# EAGLE design Emanuel textured walkway V1 (EAGLE 9.6.2)
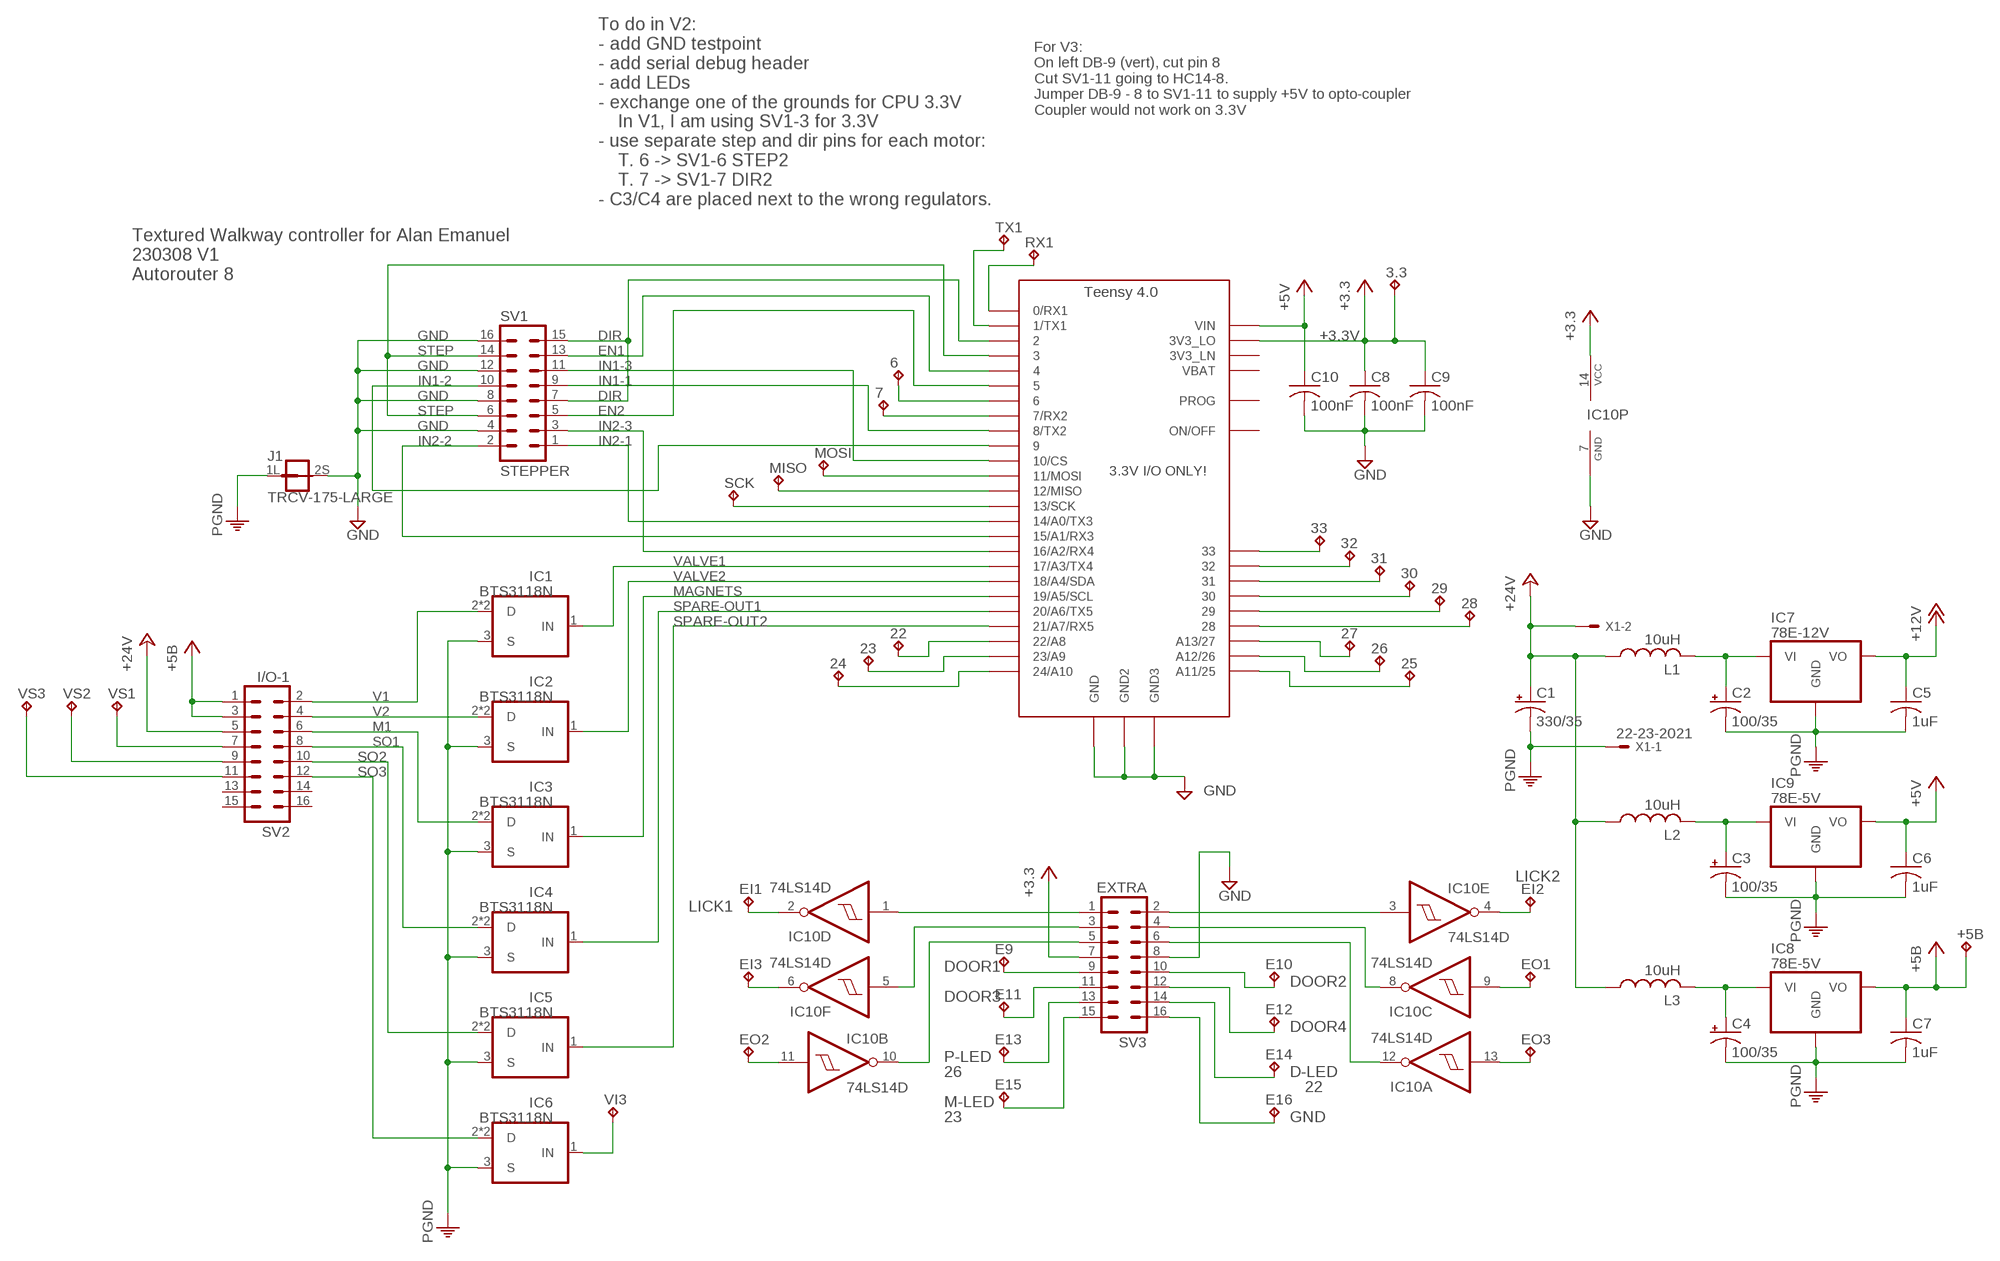
[diagram p0: schematic, sheet 1]

## Parts
3.3  3.3  TP-040-100  [P1-040-100]
6  TP-040-100  [P1-040-100]
7  TP-040-100  [P1-040-100]
22  TP-040-100  [P1-040-100]
23  TP-040-100  [P1-040-100]
24  TP-040-100  [P1-040-100]
25  TP-040-100  [P1-040-100]
26  TP-040-100  [P1-040-100]
27  TP-040-100  [P1-040-100]
28  TP-040-100  [P1-040-100]
29  TP-040-100  [P1-040-100]
30  TP-040-100  [P1-040-100]
31  TP-040-100  [P1-040-100]
32  TP-040-100  [P1-040-100]
33  TP-040-100  [P1-040-100]
+5B  TP-040-100  [P1-040-100]
C1  330/35  CPOL-US140CLH-1010  [140CLH-1010]
C2  100/35  CPOL-US140CLH-0810  [140CLH-0810]
C3  100/35  CPOL-US140CLH-0810  [140CLH-0810]
C4  100/35  CPOL-US140CLH-0810  [140CLH-0810]
C5  1uF  C-USC0805  [C0805]
C6  1uF  C-USC0805  [C0805]
C7  1uF  C-USC0805  [C0805]
C8  100nF  C-USC0805  [C0805]
C9  100nF  C-USC0805  [C0805]
C10  100nF  C-USC0805  [C0805]
E9  TP-040-100  [P1-040-100]
E10  TP-040-100  [P1-040-100]
E11  TP-040-100  [P1-040-100]
E12  TP-040-100  [P1-040-100]
E13  TP-040-100  [P1-040-100]
E14  TP-040-100  [P1-040-100]
E15  TP-040-100  [P1-040-100]
E16  TP-040-100  [P1-040-100]
EI1  TP-040-100  [P1-040-100]
EI2  TP-040-100  [P1-040-100]
EI3  TP-040-100  [P1-040-100]
EO1  TP-040-100  [P1-040-100]
EO2  TP-040-100  [P1-040-100]
EO3  TP-040-100  [P1-040-100]
IC1  BTS3118N  [SOT223]
IC2  BTS3118N  [SOT223]
IC3  BTS3118N  [SOT223]
IC4  BTS3118N  [SOT223]
IC5  BTS3118N  [SOT223]
IC6  BTS3118N  [SOT223]
IC7  78E-12V  RECOM-R-78E  [RECOM-R-78E]
IC8  78E-5V  RECOM-R-78E  [RECOM-R-78E]
IC9  78E-5V  RECOM-R-78E  [RECOM-R-78E]
IC10  74LS14D  [SO14]
J1  TRCV-175-LARGE  [JUMPER-TRACE-CONVERT-LARGER-PADS-175]
L1  10uH  L-USL1812  [L1812]
L2  10uH  L-USL1812  [L1812]
L3  10uH  L-USL1812  [L1812]
MISO  TP-040-100  [P1-040-100]
MOSI  TP-040-100  [P1-040-100]
RX1  TP-040-100  [P1-040-100]
SCK  TP-040-100  [P1-040-100]
SV1  STEPPER  ML16  [ML16]
SV2  I/O-1  ML16  [ML16]
SV3  EXTRA  ML16  [ML16]
TX1  TP-040-100  [P1-040-100]
U$1  TEENSY_4.0_WITH_24-33  [TEENSY_4.0_WITH_24-33]
VI3  TP-040-100  [P1-040-100]
VS1  TP-040-100  [P1-040-100]
VS2  TP-040-100  [P1-040-100]
VS3  TP-040-100  [P1-040-100]
X1  22-23-2021  [22-23-2021]

## Nets
+3.3V [power15]: 3.3.P$1(TP) C8.1 C9.1 IC10.14(P:VCC) SV3.7 U$1.3V3_LO ; supply symbol labelled +3.3
+5B [power15]: +5B.P$1(TP) C7.1 IC8.3(VO) SV2.1 SV2.3
+5V [power15]: C6.1 C10.1 IC9.3(VO) U$1.VIN
+12V [power15]: C5.1 IC7.3(VO)
+24V [power25]: C1.+ L1.1 L2.1 L3.1 SV2.5 X1.2
DIR: SV1.7 SV1.15 U$1.2
EN1: SV1.13 U$1.4
EN2: SV1.5 U$1.5
GND [power15]: C8.2 C9.2 C10.2 IC10.7(P:GND) J1.2S SV1.4 SV1.8 SV1.12 SV1.16 SV3.8 U$1.GND U$1.GND2 U$1.GND3
IN1-1: SV1.9 U$1.8(8/TX2)
IN1-2: SV1.10 U$1.9
IN1-3: SV1.11 U$1.10/CS
IN2-1: SV1.1 U$1.14/A0(14/A0/TX3)
IN2-2: SV1.2 U$1.15/A1(15/A1/RX3)
IN2-3: SV1.3 U$1.16/A2(16/A2/RX4)
M1 [power15]: IC3.2(D) IC3.4(D) SV2.6
MAGNETS: IC3.1(IN) U$1.19/A5/SCL
N$1 [power15]: C2.+ IC7.1(VI) L1.2
N$2 [power15]: C4.+ IC8.1(VI) L3.2
N$3 [power15]: SV2.9 VS2.P$1(TP)
N$4 [power15]: SV2.11 VS3.P$1(TP)
N$5 [power15]: C3.+ IC9.1(VI) L2.2
N$6: IC6.1(IN) VI3.P$1(TP)
N$7: MOSI.P$1(TP) U$1.11/MOSI
N$8: MISO.P$1(TP) U$1.12/MISO
N$9 [power15]: SV2.7 VS1.P$1(TP)
N$10: SCK.P$1(TP) U$1.13/SCK
N$11: 22.P$1(TP) U$1.22/A8
N$12: 23.P$1(TP) U$1.23/A9
N$13: 24.P$1(TP) U$1.24(24/A10)
N$14: 33.P$1(TP) U$1.33
N$15: 32.P$1(TP) U$1.32
N$16: 31.P$1(TP) U$1.31
N$17: 30.P$1(TP) U$1.30
N$18: 29.P$1(TP) U$1.29
N$19: 28.P$1(TP) U$1.28
N$20: 27.P$1(TP) U$1.27(A13/27)
N$21: 26.P$1(TP) U$1.26(A12/26)
N$22: 25.P$1(TP) U$1.25(A11/25)
N$23: RX1.P$1(TP) U$1.0/RX(0/RX1)
N$24: TX1.P$1(TP) U$1.1/TX(1/TX1)
N$25: 6.P$1(TP) U$1.6
N$26: 7.P$1(TP) U$1.7(7/RX2)
N$27: IC10.1(D:I) SV3.1
N$28: IC10.3(E:I) SV3.2
N$29: IC10.5(F:I) SV3.3
N$30: IC10.8(C:O) SV3.4
N$31: IC10.10(B:O) SV3.5
N$32: IC10.12(A:O) SV3.6
N$33: E9.P$1(TP) SV3.9
N$34: E11.P$1(TP) SV3.11
N$35: E13.P$1(TP) SV3.13
N$36: E15.P$1(TP) SV3.15
N$37: E10.P$1(TP) SV3.10
N$38: E12.P$1(TP) SV3.12
N$39: E14.P$1(TP) SV3.14
N$40: E16.P$1(TP) SV3.16
N$41: EI1.P$1(TP) IC10.2(D:O)
N$42: EI3.P$1(TP) IC10.6(F:O)
N$43: EI2.P$1(TP) IC10.4(E:O)
N$44: EO3.P$1(TP) IC10.13(A:I)
N$45: EO1.P$1(TP) IC10.9(C:I)
N$46: EO2.P$1(TP) IC10.11(B:I)
PGND [power25]: C1.- C2.- C3.- C4.- C5.2 C6.2 C7.2 IC1.3(S) IC2.3(S) IC3.3(S) IC4.3(S) IC5.3(S) IC6.3(S) IC7.2(GND) IC8.2(GND) IC9.2(GND) J1.1L X1.1
SO1 [power15]: IC4.2(D) IC4.4(D) SV2.8
SO2 [power15]: IC5.2(D) IC5.4(D) SV2.10
SO3 [power15]: IC6.2(D) IC6.4(D) SV2.12
SPARE-OUT1: IC4.1(IN) U$1.20/A6(20/A6/TX5)
SPARE-OUT2: IC5.1(IN) U$1.21/A7(21/A7/RX5)
STEP: SV1.6 SV1.14 U$1.3
V1 [power15]: IC1.2(D) IC1.4(D) SV2.2
V2 [power15]: IC2.2(D) IC2.4(D) SV2.4
VALVE1: IC1.1(IN) U$1.17/A3(17/A3/TX4)
VALVE2: IC2.1(IN) U$1.18/A4/SDA
Unconnected: SV2.13 SV2.14 SV2.15 SV2.16 U$1.3V3_LN U$1.ON/OFF U$1.PROG U$1.VBAT\(VBAT)

## Notes on the sheet
- For V3:
  On left DB-9 (vert), cut pin 8
  Cut SV1-11 going to HC14-8.
  Jumper DB-9 - 8 to SV1-11 to supply +5V to opto-coupler
  Coupler would not work on 3.3V
- To do in V2:
  - add GND testpoint
  - add serial debug header
  - add LEDs
  - exchange one of the grounds for CPU 3.3V
      In V1, I am using SV1-3 for 3.3V
  - use separate step and dir pins for each motor:
      T. 6 -> SV1-6 STEP2
      T. 7 -> SV1-7 DIR2
  - C3/C4 are placed next to the wrong regulators.
- Textured Walkway controller for Alan Emanuel
  230308 V1
  Autorouter 8
- LICK2
- LICK1
- DOOR1
- DOOR2
- DOOR3
- DOOR4
- P-LED
- 26 | D-LED
- 22
- M-LED
- 23 | GND

## Library data of the parts
3.3 6 7 22-33 +5B E9-E16 EI1-EI3 EO1-EO3 MISO MOSI RX1 SCK TX1 VI3 VS1-VS3 = wng:TP-040-100: Testpoint for Keystone 5002K
C1-C4 = rcl:CPOL-US: POLARIZED CAPACITOR, American symbol
C5-C10 = rcl:C-US: CAPACITOR, American symbol
IC1-IC6 = wng:BTS3118N
IC7-IC9 = wng:RECOM-R-78E
IC10 = 74xx-us:74*14: Hex schmitt trigger INVERTER
J1 = wng:TRCV-175-LARGE: Trace converter with larger pads, for power connections
L1-L3 = rcl:L-US: INDUCTOR, American symbol
SV1-SV3 = con-harting-ml:ML16: HARTING; OC_FARNELL: unknown; OC_NEWARK: unknown
U$1 = TEENSY 4.0:TEENSY_4.0_WITH_24-33
X1 = con-molex:22-23-2021: .100" (2.54mm) Center Header - 2 Pin; MF: MOLEX; MPN: 22-23-2021; OC_FARNELL: 1462926; OC_NEWARK: 25C3832

## Net classes
0 default: width 0.254 mm, drill 0.254 mm, clearance 0.254 mm
1 power15: width 0.381 mm, drill 0.381 mm, clearance 0.381 mm
2 power25: width 0.635 mm, drill 0.381 mm, clearance 0.381 mm

## Board
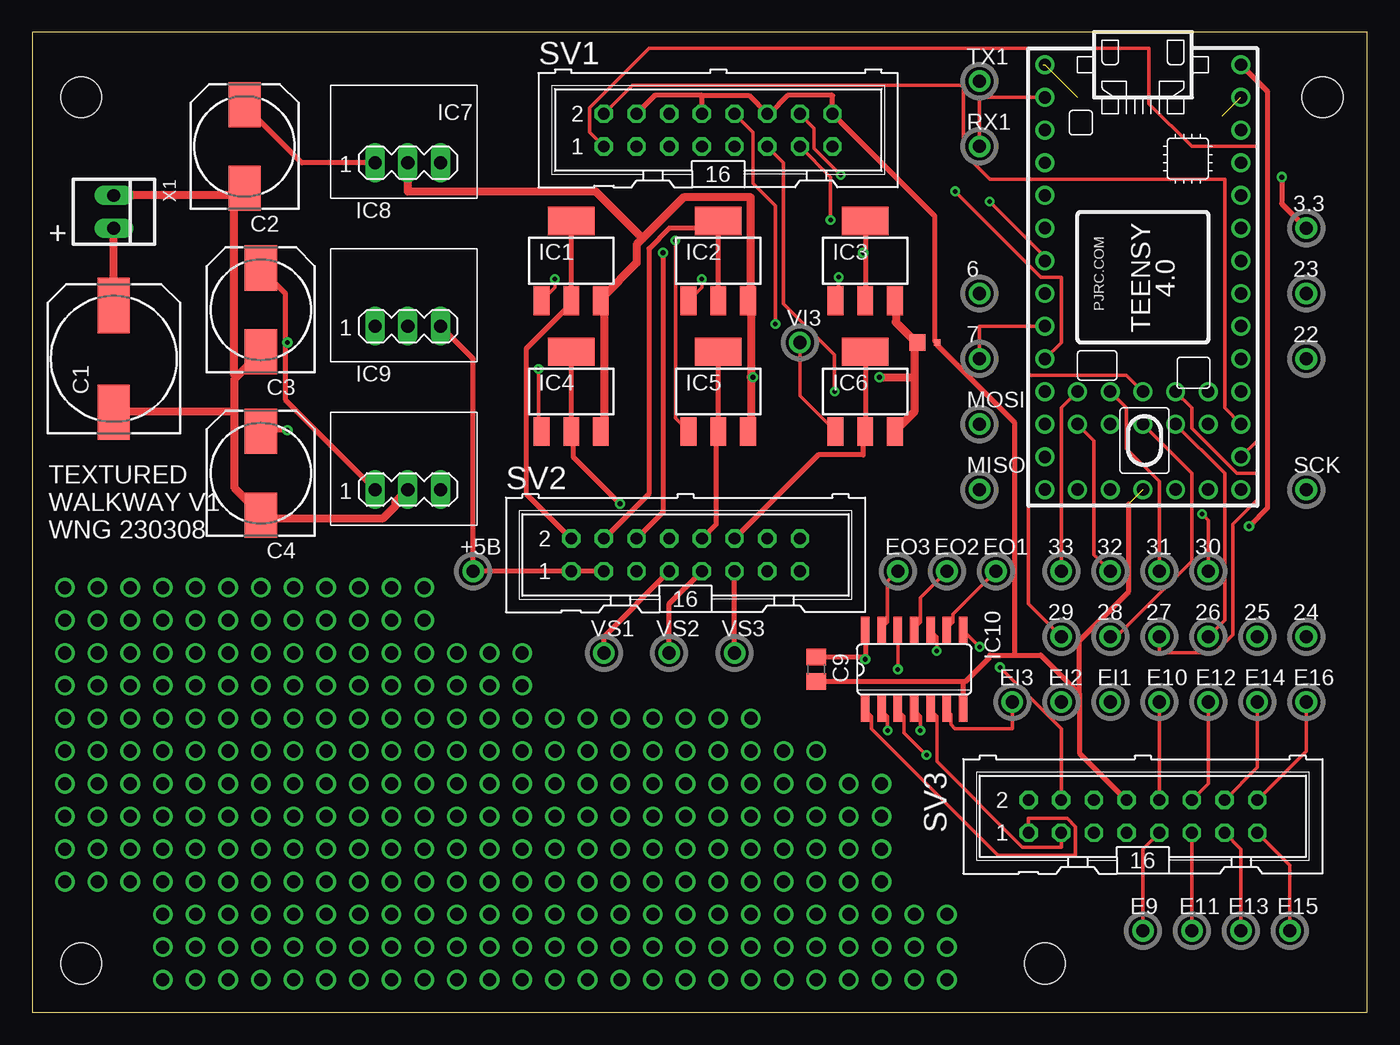
[diagram p1: board, top side]
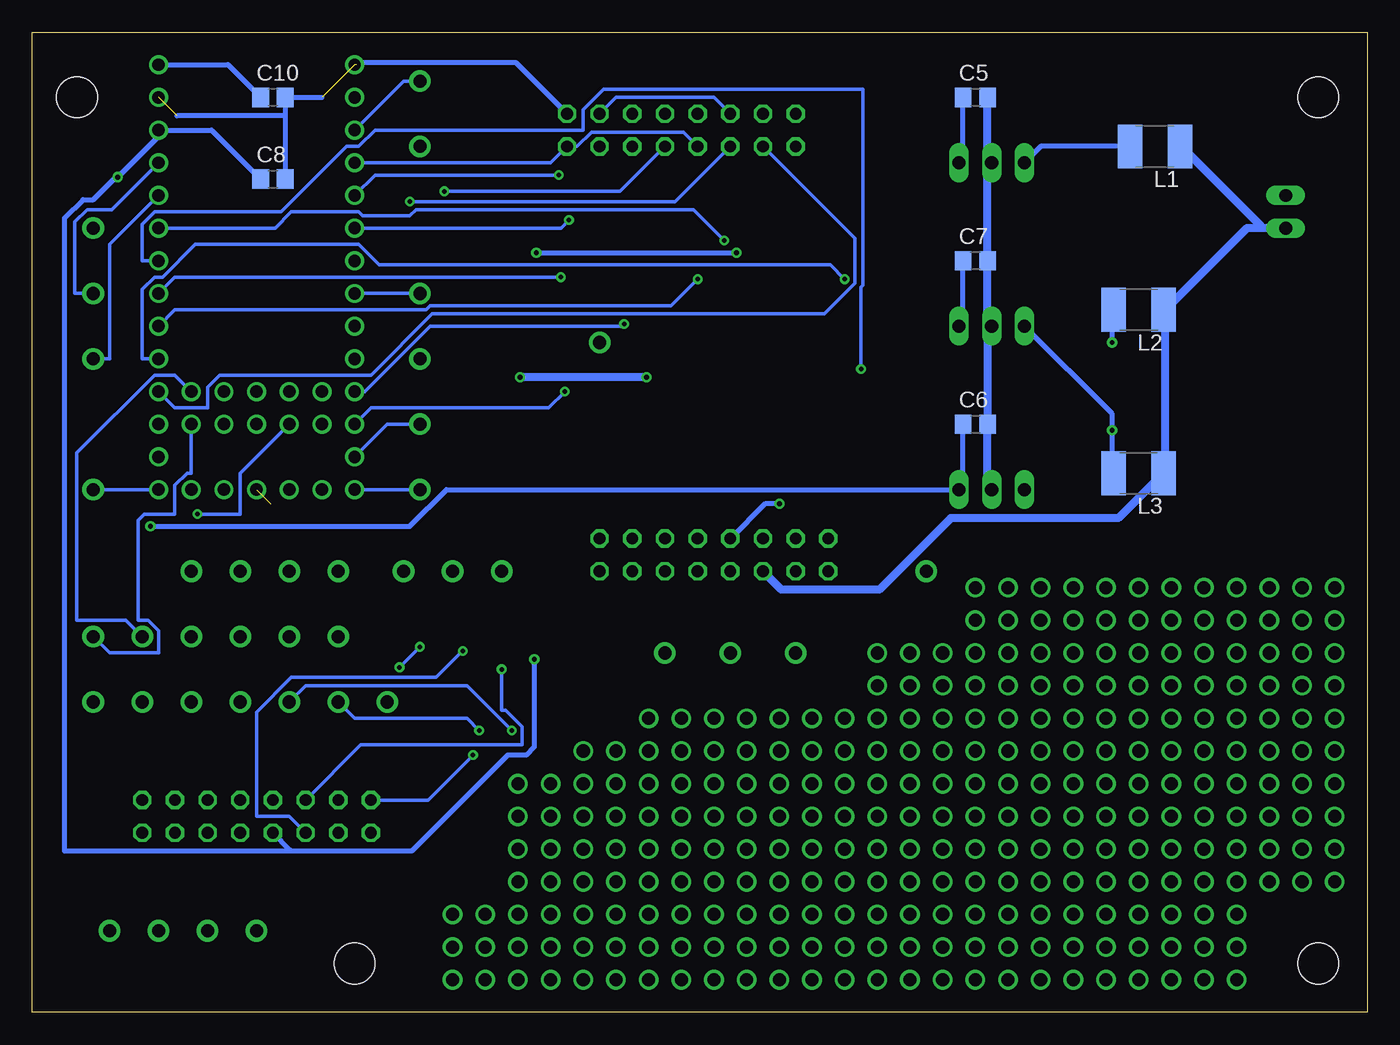
[diagram p2: board, bottom side, seen from below]

Size 103.81 x 76.19 mm. Coordinates in mm from the lower left corner, seen from the top.
Outline: 0,0 103.81,0 103.81,76.19 0,76.19 0,0
Copper layers (1*16): Top 0.035mm / dielectric 0.15mm / Bottom 0.035mm
Design rules "default *": minimum track width 10mil, minimum drill 0.35mm, track to track 8mil, track to pad 8mil, pad to pad 8mil, via to via 8mil, smd to smd 8mil, copper to edge 40mil, drill to drill 6mil, minimum pad ring 10mil, minimum via ring 8mil, stop-mask expansion 4mil, vias tented up to drill 0mil, thermal gap 10mil
Holes 3.17 mm at 3.81,71.12 100.33,71.12 3.81,3.81 78.74,3.81
tRestrict: 19 lines
bRestrict: 16 lines

### Footprints (pad centres in the part's own frame; a part is rotated, then mirrored left to right if it is on the bottom)
P1-040-100 = drill 1.016 pad 1.676: P$1 0,0
140CLH-1010 = smd 4.3 x 2.5: + 4.15,0; - -4.15,0
140CLH-0810 = smd 3.5 x 2.5: + 3.25,0; - -3.25,0
C0805 = smd 1.3 x 1.5: 1 -0.95,0; 2 0.95,0
SOT223 = smd 1.219 x 2.235: 1 -2.311,-3.099; 2 0,-3.099; 3 2.311,-3.099 | smd 3.6 x 2.2: 4 0,3.099
RECOM-R-78E = drill 1.016 long: 1 -3.81,-2.54; 2 -1.27,-2.54; 3 1.27,-2.54
SO14 = smd 0.66 x 2.032: 1 -3.81,-3.073; 2 -2.54,-3.073; 3 -1.27,-3.073; 4 0,-3.073; 5 1.27,-3.073; 6 2.54,-3.073; 7 3.81,-3.073; 8 3.81,3.073; 9 2.54,3.073; 10 1.27,3.073; 11 0,3.073; 12 -1.27,3.073; 13 -2.54,3.073; 14 -3.81,3.073
JUMPER-TRACE-CONVERT-LARGER-PADS-175 = smd 1.27 x 1.27: 1L -1.016,0 | smd 0.508 x 0.508: 2S 0.508,0
L1812 = smd 1.9 x 3.4: 1 -1.95,0; 2 1.95,0
ML16 = drill 0.914 octagon: 1 -8.89,-1.27; 2 -8.89,1.27; 3 -6.35,-1.27; 4 -6.35,1.27; 5 -3.81,-1.27; 6 -3.81,1.27; 7 -1.27,-1.27; 8 -1.27,1.27; 9 1.27,-1.27; 10 1.27,1.27; 11 3.81,-1.27; 12 3.81,1.27; 13 6.35,-1.27; 14 6.35,1.27; 15 8.89,-1.27; 16 8.89,1.27
TEENSY_4.0_WITH_24-33 = drill 0.965: 0/RX -13.97,-7.62; 1/TX -11.43,-7.62; 2 -8.89,-7.62; 3 -6.35,-7.62; 3V3_LN 16.51,-2.54; 3V3_LO -11.43,7.62; 4 -3.81,-7.62; 5 -1.27,-7.62; 6 1.27,-7.62; 7 3.81,-7.62; 8 6.35,-7.62; 9 8.89,-7.62; 10/CS 11.43,-7.62; 11/MOSI 13.97,-7.62; 12/MISO 16.51,-7.62; 13/SCK 16.51,7.62; 14/A0 13.97,7.62; 15/A1 11.43,7.62; 16/A2 8.89,7.62; 17/A3 6.35,7.62; 18/A4/SDA 3.81,7.62; 19/A5/SCL 1.27,7.62; 20/A6 -1.27,7.62; 21/A7 -3.81,7.62; 22/A8 -6.35,7.62; 23/A9 -8.89,7.62; 24 11.43,5.08; 25 8.89,5.08; 26 11.43,2.54; 27 8.89,2.54; 28 11.43,0; 29 8.89,0; 30 11.43,-2.54; 31 8.89,-2.54; 32 11.43,-5.08; 33 8.89,-5.08; GND -16.51,-7.62; GND2 -13.97,7.62; GND3 16.51,0; ON/OFF 16.51,5.08; PROG 16.51,2.54; VBAT\ 16.51,-5.08; VIN -16.51,7.62
22-23-2021 = drill 1 long: 1 -1.27,0; 2 1.27,0

### Placement (x,y rotation side)
3.3  99.06,60.96 0 top
6  73.66,55.88 0 top
7  73.66,50.8 0 top
22  99.06,50.8 0 top
23  99.06,55.88 0 top
24  99.06,29.21 0 top
25  95.25,29.21 0 top
26  91.44,29.21 0 top
27  87.63,29.21 0 top
28  83.82,29.21 0 top
29  80.01,29.21 0 top
30  91.44,34.29 0 top
31  87.63,34.29 0 top
32  83.82,34.29 0 top
33  80.01,34.29 0 top
+5B  34.29,34.29 0 top
C1  6.35,50.8 90 top
C2  16.51,67.31 90 top
C3  17.78,54.61 90 top
C4  17.78,41.91 90 top
C5  30.48,71.12 0 bottom
C6  30.48,45.72 0 bottom
C7  30.48,58.42 0 bottom
C8  85.09,64.77 0 bottom
C9  60.96,26.67 270 top
C10  85.09,71.12 0 bottom
E9  86.36,6.35 0 top
E10  87.63,24.13 0 top
E11  90.17,6.35 0 top
E12  91.44,24.13 0 top
E13  93.98,6.35 0 top
E14  95.25,24.13 0 top
E15  97.79,6.35 0 top
E16  99.06,24.13 0 top
EI1  83.82,24.13 0 top
EI2  80.01,24.13 0 top
EI3  76.2,24.13 0 top
EO1  74.93,34.29 0 top
EO2  71.12,34.29 0 top
EO3  67.31,34.29 0 top
IC1  41.91,58.42 0 top
IC2  53.34,58.42 0 top
IC3  64.77,58.42 0 top
IC4  41.91,48.26 0 top
IC5  53.34,48.26 0 top
IC6  64.77,48.26 0 top
IC7  30.48,68.58 0 top
IC8  30.48,55.88 0 top
IC9  30.48,43.18 0 top
IC10  68.58,26.67 0 top
J1  69.85,52.07 0 top
L1  16.51,67.31 180 bottom
L2  17.78,54.61 180 bottom
L3  17.78,41.91 180 bottom
MISO  73.66,40.64 0 top
MOSI  73.66,45.72 0 top
RX1  73.66,67.31 0 top
SCK  99.06,40.64 0 top
SV1  53.34,68.58 0 top
SV2  50.8,35.56 0 top
SV3  86.36,15.24 0 top
TX1  73.66,72.39 0 top
U$1  86.36,57.15 270 top
VI3  59.69,52.07 0 top
VS1  44.45,27.94 0 top
VS2  49.53,27.94 0 top
VS3  54.61,27.94 0 top
X1  6.35,62.23 270 top

### Tracks (layer width: path | path; a pad name or v marks a point on that pad's centre or on a via)
+3.3V  (via drill 0.38)
  Top 0.381: 3.3.P$1 97.16,62.87 v97.16,64.93 | 64.77,27.62 C9.1 | IC10.14 64.77,27.62 | v64.77,27.46 64.77,27.62
  Bottom 0.381: C8.1 89.85,68.58 U$1.3V3_LO 93.66,68.42 v97.16,64.93 97.31,64.93 99.06,63.18 99.85,63.18 101.28,61.75 101.28,12.54 83.82,12.54 83.74,12.62 | 83.74,12.62 83.66,12.54 74.3,12.54 66.83,20 65.41,20 64.77,20.64 v64.77,27.46 | 83.74,12.62 SV3.7
+5B
  Top 0.381: SV2.3 SV2.1 +5B.P$1 34.29,50.8 IC8.3
  Bottom 0.381: IC8.3 31.43,53.34 C7.1
+5V  (via drill 0.38)
  Top 0.381: v94.61,37.78 96.04,39.21 96.04,71.6 U$1.VIN
  Bottom 0.381: C6.1 31.43,40.64 IC9.3 71.6,40.64 74.45,37.78 v94.61,37.78 | U$1.VIN 88.58,73.66 C10.1
+12V
  Bottom 0.381: IC7.3 31.43,66.04 C5.1
+24V
  Top 0.635: C1.+ X1.2
  Bottom 0.635: X1.2 8.26,60.96 | 8.26,60.96 9.37,60.96 15.72,54.61 L2.1 15.72,54.45 15.72,42.07 L3.1 15.88,41.91 19.37,38.42 32.38,38.42 37.94,32.86 45.56,32.86 SV2.5 | L1.1 14.45,67.31 8.26,61.12 8.26,60.96
DIR
  Bottom 0.254: SV1.7 53.18,68.42 60.33,68.42 61.44,67.31 SV1.15 63.5,66.04 U$1.2
EN1  (via drill 0.35)
  Top 0.254: SV1.13 62.07,64.93 v62.07,61.59
  Bottom 0.254: v62.07,61.59 62.71,60.96 U$1.4
EN2  (via drill 0.35)
  Top 0.254: v74.45,63.02 78.74,58.74 U$1.5
  Bottom 0.254: SV1.5 53.82,63.02 v74.45,63.02
GND  (4 unrouted)
  Top 0.381: 72.39,25.72 C9.2 | IC10.7 72.39,25.72 | SV3.8 81.44,20.16 81.44,24.77 | 81.44,24.77 78.42,27.78 76.36,27.78 | 76.36,27.78 74.45,27.78 74.45,27.62 72.55,25.72 72.39,25.72 | 85.25,39.53 85.25,32.7 81.44,28.89 81.44,24.77 | SV1.4 48.42,71.28 52.07,71.28 | SV1.8 52.07,71.28 | 52.07,71.28 55.72,71.28 SV1.12 57.31,69.85 58.74,71.28 62.23,71.28 SV1.16 70.17,61.91 70.17,52.23 70.33,52.07 J1.2S 70.33,51.91 76.36,45.88 76.36,27.78
  Bottom 0.381: 84.14,69.69 C10.2 81.28,71.12 | 84.14,69.69 C8.2 | 84.14,69.69 92.55,69.69 | 78.58,73.66 78.42,73.82 66.2,73.82 SV1.16
IN1-1  (via drill 0.35)
  Top 0.254: v71.75,63.82 78.42,57.15 80.01,57.15 80.01,52.07 U$1.8
  Bottom 0.254: SV1.9 58.1,63.82 v71.75,63.82
IN1-2  (via drill 0.35)
  Top 0.254: SV1.10 56.04,68.42 56.04,64.45 57.78,62.71 v57.78,53.5
  Bottom 0.254: v57.78,53.5 57.94,53.34 72.87,53.34 77.95,48.26 U$1.9
IN1-3  (via drill 0.35)
  Top 0.254: SV1.11 58.42,66.04 58.42,55.09 62.39,51.12 v62.39,48.26
  Bottom 0.254: v62.39,48.26 63.66,46.99 77.47,46.99 U$1.10/CS
IN2-1
  Top 0.254: SV1.1 43.34,68.42 43.34,70.33 47.94,74.93 86.84,74.93 86.84,70.64 90.17,67.31 95.25,67.31 95.25,44.45 U$1.14/A0
IN2-2
  Top 0.254: SV1.2 46.67,72.07 72.39,72.07 72.39,66.83 74.45,64.77 92.71,64.77 92.71,46.99 U$1.15/A1
IN2-3
  Bottom 0.254: SV1.3 39.85,60.17 39.85,56.67 42.23,54.29 72.71,54.29 77.47,49.53 89.22,49.53 90.17,48.58 90.17,46.99 92.71,46.99 U$1.16/A2
M1  (via drill 0.38)
  Top 0.381: IC3.4 64.77,59.05 | 64.77,59.05 IC3.2 | SV2.6 49.05,38.89 v49.05,59.05 | v64.61,59.05 64.77,59.05
  Bottom 0.381: v64.61,59.05 v49.05,59.05
MAGNETS  (via drill 0.35)
  Top 0.254: v62.71,57.15 62.71,55.56 62.55,55.4 IC3.1
  Bottom 0.254: v62.71,57.15 92.71,57.15 U$1.19/A5/SCL
N$1
  Top 0.381: IC7.1 20.95,66.04 16.51,70.48 C2.+
  Bottom 0.381: IC7.1 25.4,67.31 L1.2
N$2  (via drill 0.38)
  Top 0.381: v19.84,45.24 17.78,45.24 C4.+
  Bottom 0.381: IC8.1 19.84,46.51 v19.84,45.24 19.84,41.91 L3.2
N$3
  Top 0.381: SV2.9 49.53,31.75 VS2.P$1
N$4
  Top 0.381: VS3.P$1 SV2.11
N$5  (via drill 0.38)
  Top 0.381: IC9.1 19.68,47.62 19.68,52.07 | 19.68,52.07 19.68,55.88 17.78,57.78 C3.+ | v19.84,52.07 19.68,52.07
  Bottom 0.381: v19.84,52.07 19.84,54.61 L2.2
N$6
  Top 0.254: VI3.P$1 59.69,47.94 62.39,45.24 IC6.1
N$7
  Bottom 0.254: U$1.11/MOSI 76.2,45.72 MOSI.P$1
N$8
  Bottom 0.254: MISO.P$1 U$1.12/MISO
N$9
  Top 0.381: SV2.7 44.45,29.21 VS1.P$1
N$10
  Bottom 0.254: SCK.P$1 U$1.13/SCK
N$11
  Bottom 0.254: U$1.22/A8 97.79,59.69 97.79,50.8 22.P$1
N$12
  Bottom 0.254: U$1.23/A9 97.63,62.39 99.54,62.39 100.49,61.44 100.49,55.88 23.P$1
N$13
  Bottom 0.254: U$1.24 91.44,41.91 91.76,41.91 92.71,40.96 92.71,38.73 95.09,38.73 95.57,38.26 95.57,30.48 94.77,30.48 93.98,29.69 93.98,27.94 97.79,27.94 24.P$1
N$14
  Top 0.254: U$1.33 80.01,46.99 33.P$1
N$15
  Top 0.254: U$1.32 82.55,44.45 82.55,35.56 32.P$1
N$16
  Top 0.254: U$1.31 85.09,46.99 85.09,43.81 87.63,41.27 31.P$1
N$17  (via drill 0.35)
  Top 0.254: v90.96,38.73 91.44,38.26 30.P$1
  Bottom 0.254: U$1.30 87.63,41.91 87.63,38.73 v90.96,38.73
N$18
  Top 0.254: U$1.29 85.09,49.53 77.47,49.53 77.47,31.75 29.P$1
N$19
  Top 0.254: U$1.28 90.17,41.91 90.17,35.08 84.3,29.21 28.P$1
N$20
  Top 0.254: U$1.27 90.17,46.99 90.17,45.4 93.66,41.91 95.25,41.91 95.25,39.85 93.34,37.94 93.34,29.37 91.92,27.94 87.63,27.94 27.P$1
N$21
  Top 0.254: U$1.26 92.71,41.91 92.71,30.48 26.P$1
N$22
  Bottom 0.254: U$1.25 92.71,49.53 94.3,49.53 100.33,43.5 100.33,30.48 96.52,30.48 25.P$1
N$23
  Top 0.254: U$1.0/RX 73.66,71.12 RX1.P$1
N$24
  Bottom 0.254: U$1.1/TX 74.93,72.39 TX1.P$1
N$25
  Bottom 0.254: 6.P$1 U$1.6
N$26
  Top 0.254: U$1.7 73.66,53.34 7.P$1
N$27
  Top 0.254: SV3.1 77.47,15.08 80.49,15.08 81.12,14.45 81.12,12.22 75.09,12.22 65.25,22.07 65.25,23.02 64.77,23.5 IC10.1
N$28  (via drill 0.35)
  Top 0.254: v69.53,20 67.79,21.75 67.79,23.02 67.31,23.5 IC10.3
  Bottom 0.254: v69.53,20 73.03,16.51 SV3.2
N$29
  Top 0.254: SV3.3 80.01,12.86 76.99,12.86 70.33,19.53 70.33,23.02 69.85,23.5 IC10.5
N$30  (via drill 0.35)
  Top 0.254: v73.66,28.42 72.39,29.69 IC10.8 | v75.25,26.83 80.01,22.07 SV3.4
  Bottom 0.254: v75.25,26.83 v73.66,28.42
N$31  (via drill 0.35)
  Top 0.254: v70.33,28.1 70.33,29.21 69.85,29.69 IC10.10
  Bottom 0.254: v70.33,28.1 72.39,26.04 83.66,26.04 86.36,23.34 86.36,15.24 83.82,15.24 SV3.5
N$32  (via drill 0.35)
  Top 0.254: v67.31,26.67 IC10.12
  Bottom 0.254: v67.31,26.67 67.31,23.5 66.99,23.5 65.72,22.23 65.72,20.8 78.26,20.8 SV3.6
N$33
  Top 0.254: SV3.9 86.36,12.7 E9.P$1
N$34
  Top 0.254: E11.P$1 SV3.11
N$35
  Top 0.254: SV3.13 93.98,12.7 E13.P$1
N$36
  Top 0.254: SV3.15 97.79,11.43 E15.P$1
N$37
  Top 0.254: E10.P$1 SV3.10
N$38
  Top 0.254: SV3.12 91.44,17.78 E12.P$1
N$39
  Top 0.254: SV3.14 95.25,19.05 E14.P$1
N$40
  Top 0.254: SV3.16 99.06,20.32 E16.P$1
N$41  (via drill 0.35)
  Top 0.254: v66.52,21.91 66.52,23.02 66.04,23.5 IC10.2
  Bottom 0.254: v66.52,21.91 70.01,25.4 82.55,25.4 EI1.P$1
N$42
  Top 0.254: EI3.P$1 76.2,22.07 71.75,22.07 71.44,22.38 71.44,23.18 71.12,23.5 IC10.6
N$43  (via drill 0.35)
  Top 0.254: v69.06,21.91 69.06,23.02 68.58,23.5 IC10.4
  Bottom 0.254: v69.06,21.91 70.01,22.86 78.74,22.86 EI2.P$1
N$44
  Top 0.254: EO3.P$1 66.52,33.5 66.52,30.32 66.04,29.84 IC10.13
N$45
  Top 0.254: EO1.P$1 71.6,30.96 71.6,30.32 71.12,29.84 IC10.9
N$46
  Top 0.254: EO2.P$1 69.06,32.23 69.06,30.32 68.58,29.84 IC10.11
N$47  (via drill 1.02)
  other vias: 2.54,33.02
N$48  (via drill 1.02)
  other vias: 5.08,33.02
N$49  (via drill 1.02)
  other vias: 7.62,33.02
N$50  (via drill 1.02)
  other vias: 10.16,33.02
N$51  (via drill 1.02)
  other vias: 12.7,33.02
N$52  (via drill 1.02)
  other vias: 15.24,33.02
N$53  (via drill 1.02)
  other vias: 17.78,33.02
N$54  (via drill 1.02)
  other vias: 20.32,33.02
N$55  (via drill 1.02)
  other vias: 22.86,33.02
N$56  (via drill 1.02)
  other vias: 25.4,33.02
N$57  (via drill 1.02)
  other vias: 27.94,33.02
N$58  (via drill 1.02)
  other vias: 30.48,33.02
N$59  (via drill 1.02)
  other vias: 2.54,30.48
N$60  (via drill 1.02)
  other vias: 5.08,30.48
N$61  (via drill 1.02)
  other vias: 7.62,30.48
N$62  (via drill 1.02)
  other vias: 10.16,30.48
N$63  (via drill 1.02)
  other vias: 12.7,30.48
N$64  (via drill 1.02)
  other vias: 15.24,30.48
N$65  (via drill 1.02)
  other vias: 17.78,30.48
N$66  (via drill 1.02)
  other vias: 20.32,30.48
N$67  (via drill 1.02)
  other vias: 22.86,30.48
N$68  (via drill 1.02)
  other vias: 25.4,30.48
N$69  (via drill 1.02)
  other vias: 27.94,30.48
N$70  (via drill 1.02)
  other vias: 30.48,30.48
N$71  (via drill 1.02)
  other vias: 2.54,27.94
N$72  (via drill 1.02)
  other vias: 5.08,27.94
N$73  (via drill 1.02)
  other vias: 7.62,27.94
N$74  (via drill 1.02)
  other vias: 10.16,27.94
N$75  (via drill 1.02)
  other vias: 12.7,27.94
N$76  (via drill 1.02)
  other vias: 15.24,27.94
N$77  (via drill 1.02)
  other vias: 17.78,27.94
N$78  (via drill 1.02)
  other vias: 20.32,27.94
N$79  (via drill 1.02)
  other vias: 22.86,27.94
N$80  (via drill 1.02)
  other vias: 25.4,27.94
N$81  (via drill 1.02)
  other vias: 27.94,27.94
N$82  (via drill 1.02)
  other vias: 30.48,27.94
N$83  (via drill 1.02)
  other vias: 2.54,25.4
N$84  (via drill 1.02)
  other vias: 5.08,25.4
N$85  (via drill 1.02)
  other vias: 7.62,25.4
N$86  (via drill 1.02)
  other vias: 10.16,25.4
N$87  (via drill 1.02)
  other vias: 12.7,25.4
N$88  (via drill 1.02)
  other vias: 15.24,25.4
N$89  (via drill 1.02)
  other vias: 17.78,25.4
N$90  (via drill 1.02)
  other vias: 20.32,25.4
N$91  (via drill 1.02)
  other vias: 22.86,25.4
N$92  (via drill 1.02)
  other vias: 25.4,25.4
N$93  (via drill 1.02)
  other vias: 27.94,25.4
N$94  (via drill 1.02)
  other vias: 30.48,25.4
N$95  (via drill 1.02)
  other vias: 33.02,25.4
N$96  (via drill 1.02)
  other vias: 35.56,25.4
N$97  (via drill 1.02)
  other vias: 38.1,25.4
N$98  (via drill 1.02)
  other vias: 2.54,22.86
N$99  (via drill 1.02)
  other vias: 5.08,22.86
N$100  (via drill 1.02)
  other vias: 7.62,22.86
N$101  (via drill 1.02)
  other vias: 10.16,22.86
N$102  (via drill 1.02)
  other vias: 12.7,22.86
N$103  (via drill 1.02)
  other vias: 15.24,22.86
N$104  (via drill 1.02)
  other vias: 17.78,22.86
N$105  (via drill 1.02)
  other vias: 20.32,22.86
N$106  (via drill 1.02)
  other vias: 22.86,22.86
N$107  (via drill 1.02)
  other vias: 25.4,22.86
N$108  (via drill 1.02)
  other vias: 27.94,22.86
N$109  (via drill 1.02)
  other vias: 30.48,22.86
N$110  (via drill 1.02)
  other vias: 33.02,22.86
N$111  (via drill 1.02)
  other vias: 35.56,22.86
N$112  (via drill 1.02)
  other vias: 38.1,22.86
N$113  (via drill 1.02)
  other vias: 40.64,22.86
N$114  (via drill 1.02)
  other vias: 43.18,22.86
N$115  (via drill 1.02)
  other vias: 45.72,22.86
N$116  (via drill 1.02)
  other vias: 48.26,22.86
N$117  (via drill 1.02)
  other vias: 50.8,22.86
N$118  (via drill 1.02)
  other vias: 53.34,22.86
N$119  (via drill 1.02)
  other vias: 2.54,20.32
N$120  (via drill 1.02)
  other vias: 5.08,20.32
N$121  (via drill 1.02)
  other vias: 7.62,20.32
N$122  (via drill 1.02)
  other vias: 10.16,20.32
N$123  (via drill 1.02)
  other vias: 12.7,20.32
N$124  (via drill 1.02)
  other vias: 15.24,20.32
N$125  (via drill 1.02)
  other vias: 17.78,20.32
N$126  (via drill 1.02)
  other vias: 20.32,20.32
N$127  (via drill 1.02)
  other vias: 22.86,20.32
N$128  (via drill 1.02)
  other vias: 25.4,20.32
N$129  (via drill 1.02)
  other vias: 27.94,20.32
N$130  (via drill 1.02)
  other vias: 30.48,20.32
N$131  (via drill 1.02)
  other vias: 33.02,20.32
N$132  (via drill 1.02)
  other vias: 35.56,20.32
N$133  (via drill 1.02)
  other vias: 38.1,20.32
N$134  (via drill 1.02)
  other vias: 40.64,20.32
N$135  (via drill 1.02)
  other vias: 43.18,20.32
N$136  (via drill 1.02)
  other vias: 45.72,20.32
N$137  (via drill 1.02)
  other vias: 48.26,20.32
N$138  (via drill 1.02)
  other vias: 50.8,20.32
N$139  (via drill 1.02)
  other vias: 53.34,20.32
N$140  (via drill 1.02)
  other vias: 55.88,20.32
N$141  (via drill 1.02)
  other vias: 55.88,22.86
N$142  (via drill 1.02)
  other vias: 2.54,17.78
N$143  (via drill 1.02)
  other vias: 5.08,17.78
N$144  (via drill 1.02)
  other vias: 7.62,17.78
N$145  (via drill 1.02)
  other vias: 10.16,17.78
N$146  (via drill 1.02)
  other vias: 12.7,17.78
N$147  (via drill 1.02)
  other vias: 15.24,17.78
N$148  (via drill 1.02)
  other vias: 17.78,17.78
N$149  (via drill 1.02)
  other vias: 20.32,17.78
N$150  (via drill 1.02)
  other vias: 22.86,17.78
N$151  (via drill 1.02)
  other vias: 25.4,17.78
N$152  (via drill 1.02)
  other vias: 27.94,17.78
N$153  (via drill 1.02)
  other vias: 30.48,17.78
N$154  (via drill 1.02)
  other vias: 33.02,17.78
N$155  (via drill 1.02)
  other vias: 35.56,17.78
N$156  (via drill 1.02)
  other vias: 38.1,17.78
N$157  (via drill 1.02)
  other vias: 40.64,17.78
N$158  (via drill 1.02)
  other vias: 43.18,17.78
N$159  (via drill 1.02)
  other vias: 45.72,17.78
N$160  (via drill 1.02)
  other vias: 48.26,17.78
N$161  (via drill 1.02)
  other vias: 50.8,17.78
N$162  (via drill 1.02)
  other vias: 53.34,17.78
N$163  (via drill 1.02)
  other vias: 55.88,17.78
N$164  (via drill 1.02)
  other vias: 58.42,17.78
N$165  (via drill 1.02)
  other vias: 60.96,17.78
N$166  (via drill 1.02)
  other vias: 58.42,20.32
N$167  (via drill 1.02)
  other vias: 60.96,20.32
N$168  (via drill 1.02)
  other vias: 2.54,15.24
N$169  (via drill 1.02)
  other vias: 5.08,15.24
N$170  (via drill 1.02)
  other vias: 7.62,15.24
N$171  (via drill 1.02)
  other vias: 10.16,15.24
N$172  (via drill 1.02)
  other vias: 12.7,15.24
N$173  (via drill 1.02)
  other vias: 15.24,15.24
N$174  (via drill 1.02)
  other vias: 17.78,15.24
N$175  (via drill 1.02)
  other vias: 20.32,15.24
N$176  (via drill 1.02)
  other vias: 22.86,15.24
N$177  (via drill 1.02)
  other vias: 25.4,15.24
N$178  (via drill 1.02)
  other vias: 27.94,15.24
N$179  (via drill 1.02)
  other vias: 30.48,15.24
N$180  (via drill 1.02)
  other vias: 33.02,15.24
N$181  (via drill 1.02)
  other vias: 35.56,15.24
N$182  (via drill 1.02)
  other vias: 38.1,15.24
N$183  (via drill 1.02)
  other vias: 40.64,15.24
N$184  (via drill 1.02)
  other vias: 43.18,15.24
N$185  (via drill 1.02)
  other vias: 45.72,15.24
N$186  (via drill 1.02)
  other vias: 48.26,15.24
N$187  (via drill 1.02)
  other vias: 50.8,15.24
N$188  (via drill 1.02)
  other vias: 53.34,15.24
N$189  (via drill 1.02)
  other vias: 55.88,15.24
N$190  (via drill 1.02)
  other vias: 58.42,15.24
N$191  (via drill 1.02)
  other vias: 60.96,15.24
N$192  (via drill 1.02)
  other vias: 63.5,15.24
N$193  (via drill 1.02)
  other vias: 66.04,15.24
N$194  (via drill 1.02)
  other vias: 63.5,17.78
N$195  (via drill 1.02)
  other vias: 66.04,17.78
N$196  (via drill 1.02)
  other vias: 33.02,27.94
N$197  (via drill 1.02)
  other vias: 35.56,27.94
N$198  (via drill 1.02)
  other vias: 38.1,27.94
N$199  (via drill 1.02)
  other vias: 2.54,12.7
N$200  (via drill 1.02)
  other vias: 5.08,12.7
N$201  (via drill 1.02)
  other vias: 7.62,12.7
N$202  (via drill 1.02)
  other vias: 10.16,12.7
N$203  (via drill 1.02)
  other vias: 12.7,12.7
N$204  (via drill 1.02)
  other vias: 15.24,12.7
N$205  (via drill 1.02)
  other vias: 17.78,12.7
N$206  (via drill 1.02)
  other vias: 20.32,12.7
N$207  (via drill 1.02)
  other vias: 22.86,12.7
N$208  (via drill 1.02)
  other vias: 25.4,12.7
N$209  (via drill 1.02)
  other vias: 27.94,12.7
N$210  (via drill 1.02)
  other vias: 30.48,12.7
N$211  (via drill 1.02)
  other vias: 33.02,12.7
N$212  (via drill 1.02)
  other vias: 35.56,12.7
N$213  (via drill 1.02)
  other vias: 38.1,12.7
N$214  (via drill 1.02)
  other vias: 40.64,12.7
N$215  (via drill 1.02)
  other vias: 43.18,12.7
N$216  (via drill 1.02)
  other vias: 45.72,12.7
N$217  (via drill 1.02)
  other vias: 48.26,12.7
N$218  (via drill 1.02)
  other vias: 50.8,12.7
N$219  (via drill 1.02)
  other vias: 53.34,12.7
N$220  (via drill 1.02)
  other vias: 55.88,12.7
N$221  (via drill 1.02)
  other vias: 58.42,12.7
N$222  (via drill 1.02)
  other vias: 60.96,12.7
N$223  (via drill 1.02)
  other vias: 63.5,12.7
N$224  (via drill 1.02)
  other vias: 66.04,12.7
N$225  (via drill 1.02)
  other vias: 2.54,10.16
N$226  (via drill 1.02)
  other vias: 5.08,10.16
N$227  (via drill 1.02)
  other vias: 7.62,10.16
N$228  (via drill 1.02)
  other vias: 10.16,10.16
N$229  (via drill 1.02)
  other vias: 12.7,10.16
N$230  (via drill 1.02)
  other vias: 15.24,10.16
N$231  (via drill 1.02)
  other vias: 17.78,10.16
N$232  (via drill 1.02)
  other vias: 20.32,10.16
N$233  (via drill 1.02)
  other vias: 22.86,10.16
N$234  (via drill 1.02)
  other vias: 25.4,10.16
N$235  (via drill 1.02)
  other vias: 27.94,10.16
N$236  (via drill 1.02)
  other vias: 30.48,10.16
N$237  (via drill 1.02)
  other vias: 33.02,10.16
N$238  (via drill 1.02)
  other vias: 35.56,10.16
N$239  (via drill 1.02)
  other vias: 38.1,10.16
N$240  (via drill 1.02)
  other vias: 40.64,10.16
N$241  (via drill 1.02)
  other vias: 43.18,10.16
N$242  (via drill 1.02)
  other vias: 45.72,10.16
N$243  (via drill 1.02)
  other vias: 48.26,10.16
N$244  (via drill 1.02)
  other vias: 50.8,10.16
N$245  (via drill 1.02)
  other vias: 53.34,10.16
N$246  (via drill 1.02)
  other vias: 55.88,10.16
N$247  (via drill 1.02)
  other vias: 58.42,10.16
N$248  (via drill 1.02)
  other vias: 60.96,10.16
N$249  (via drill 1.02)
  other vias: 63.5,10.16
N$250  (via drill 1.02)
  other vias: 66.04,10.16
N$252  (via drill 1.02)
  other vias: 10.16,7.62
N$253  (via drill 1.02)
  other vias: 12.7,7.62
N$254  (via drill 1.02)
  other vias: 15.24,7.62
N$255  (via drill 1.02)
  other vias: 17.78,7.62
N$256  (via drill 1.02)
  other vias: 20.32,7.62
N$257  (via drill 1.02)
  other vias: 22.86,7.62
N$258  (via drill 1.02)
  other vias: 25.4,7.62
N$259  (via drill 1.02)
  other vias: 27.94,7.62
N$260  (via drill 1.02)
  other vias: 30.48,7.62
N$261  (via drill 1.02)
  other vias: 33.02,7.62
N$262  (via drill 1.02)
  other vias: 35.56,7.62
N$263  (via drill 1.02)
  other vias: 38.1,7.62
N$264  (via drill 1.02)
  other vias: 40.64,7.62
N$265  (via drill 1.02)
  other vias: 43.18,7.62
N$266  (via drill 1.02)
  other vias: 45.72,7.62
N$267  (via drill 1.02)
  other vias: 48.26,7.62
N$268  (via drill 1.02)
  other vias: 50.8,7.62
N$269  (via drill 1.02)
  other vias: 53.34,7.62
N$270  (via drill 1.02)
  other vias: 55.88,7.62
N$271  (via drill 1.02)
  other vias: 58.42,7.62
N$272  (via drill 1.02)
  other vias: 60.96,7.62
N$273  (via drill 1.02)
  other vias: 63.5,7.62
N$274  (via drill 1.02)
  other vias: 66.04,7.62
N$275  (via drill 1.02)
  other vias: 68.58,7.62
N$276  (via drill 1.02)
  other vias: 71.12,7.62
N$277  (via drill 1.02)
  other vias: 10.16,5.08
N$278  (via drill 1.02)
  other vias: 12.7,5.08
N$279  (via drill 1.02)
  other vias: 15.24,5.08
N$280  (via drill 1.02)
  other vias: 17.78,5.08
N$281  (via drill 1.02)
  other vias: 20.32,5.08
N$282  (via drill 1.02)
  other vias: 22.86,5.08
N$283  (via drill 1.02)
  other vias: 25.4,5.08
N$284  (via drill 1.02)
  other vias: 27.94,5.08
N$285  (via drill 1.02)
  other vias: 30.48,5.08
N$286  (via drill 1.02)
  other vias: 33.02,5.08
N$287  (via drill 1.02)
  other vias: 35.56,5.08
N$288  (via drill 1.02)
  other vias: 38.1,5.08
N$289  (via drill 1.02)
  other vias: 40.64,5.08
N$290  (via drill 1.02)
  other vias: 43.18,5.08
N$291  (via drill 1.02)
  other vias: 45.72,5.08
N$292  (via drill 1.02)
  other vias: 48.26,5.08
N$293  (via drill 1.02)
  other vias: 50.8,5.08
N$294  (via drill 1.02)
  other vias: 53.34,5.08
N$295  (via drill 1.02)
  other vias: 71.12,5.08
N$296  (via drill 1.02)
  other vias: 68.58,5.08
N$297  (via drill 1.02)
  other vias: 66.04,5.08
N$298  (via drill 1.02)
  other vias: 63.5,5.08
N$299  (via drill 1.02)
  other vias: 60.96,5.08
N$300  (via drill 1.02)
  other vias: 58.42,5.08
N$301  (via drill 1.02)
  other vias: 10.16,2.54
N$302  (via drill 1.02)
  other vias: 12.7,2.54
N$303  (via drill 1.02)
  other vias: 15.24,2.54
N$304  (via drill 1.02)
  other vias: 17.78,2.54
N$305  (via drill 1.02)
  other vias: 20.32,2.54
N$306  (via drill 1.02)
  other vias: 22.86,2.54
N$307  (via drill 1.02)
  other vias: 25.4,2.54
N$308  (via drill 1.02)
  other vias: 27.94,2.54
N$309  (via drill 1.02)
  other vias: 30.48,2.54
N$310  (via drill 1.02)
  other vias: 33.02,2.54
N$311  (via drill 1.02)
  other vias: 35.56,2.54
N$312  (via drill 1.02)
  other vias: 38.1,2.54
N$313  (via drill 1.02)
  other vias: 40.64,2.54
N$314  (via drill 1.02)
  other vias: 43.18,2.54
N$315  (via drill 1.02)
  other vias: 45.72,2.54
N$316  (via drill 1.02)
  other vias: 48.26,2.54
N$317  (via drill 1.02)
  other vias: 50.8,2.54
N$318  (via drill 1.02)
  other vias: 53.34,2.54
N$319  (via drill 1.02)
  other vias: 55.88,2.54
N$320  (via drill 1.02)
  other vias: 58.42,2.54
N$321  (via drill 1.02)
  other vias: 60.96,2.54
N$322  (via drill 1.02)
  other vias: 63.5,2.54
N$323  (via drill 1.02)
  other vias: 66.04,2.54
N$324  (via drill 1.02)
  other vias: 68.58,2.54
N$325  (via drill 1.02)
  other vias: 71.12,2.54
N$326  (via drill 1.02)
  other vias: 55.88,5.08
PGND  (via drill 0.38)
  Top 0.635: IC3.3 67.15,55.24 67.15,53.66 68.74,52.07 J1.1L 68.58,51.91 68.58,49.37 | 68.58,49.37 68.58,46.67 67.15,45.24 IC6.3 | IC4.3 44.29,45.24 44.45,45.4 44.45,55.09 44.29,55.24 IC1.3 44.29,55.56 46.99,58.26 46.99,59.69 47.47,60.17 | 55.88,49.37 55.88,55.09 55.72,55.24 IC2.3 55.88,55.4 55.88,63.34 50.64,63.34 47.47,60.17 | 55.88,49.37 55.88,45.4 55.72,45.24 IC5.3 | v65.88,49.37 68.58,49.37 | v56.04,49.37 55.88,49.37 | X1.1 16.51,63.5 C2.- 15.72,63.34 15.72,49.53 15.88,49.37 | 15.72,46.67 15.72,49.21 15.88,49.37 | 15.72,46.67 15.72,40.8 17.78,38.73 C4.- 17.94,38.42 27.3,38.42 28.26,39.37 28.26,39.69 IC9.2 | 15.88,49.37 17.78,51.28 C3.- | 15.72,46.67 6.35,46.67 C1.- | 47.47,60.17 43.81,63.82 29.21,63.82 IC7.2
  Bottom 0.635: v56.04,49.37 v65.88,49.37 | C5.2 29.53,66.04 IC7.2 29.53,65.88 29.53,58.58 C7.2 29.53,53.34 IC8.2 29.53,53.18 29.53,45.88 C6.2 29.53,40.64 IC9.2
SO1  (via drill 0.38)
  Top 0.381: IC4.4 IC4.2 42.07,45.09 42.07,43.18 v45.72,39.53
  Bottom 0.381: SV2.8 46.83,39.53 v45.72,39.53
SO2
  Top 0.381: IC5.4 IC5.2 53.18,45.09 53.18,37.94 SV2.10
SO3
  Top 0.381: IC6.4 IC6.2 64.61,45.09 64.61,43.34 61.12,43.34 SV2.12
SPARE-OUT1  (via drill 0.35)
  Top 0.254: v39.37,50.01 39.37,45.4 39.53,45.24 IC4.1
  Bottom 0.254: v39.37,50.01 39.37,56.36 39.21,56.52 39.21,71.75 59.37,71.75 60.96,70.17 60.96,68.58 77.15,68.58 78.42,67.31 79.38,67.31 84.45,62.23 94.3,62.23 95.25,61.28 95.25,58.42 U$1.20/A6
SPARE-OUT2  (via drill 0.35)
  Top 0.254: v50.01,60.01 50.01,46.2 50.96,45.24 IC5.1
  Bottom 0.254: v50.01,60.01 52.39,62.39 73.98,62.39 74.45,61.91 78.11,61.91 78.42,62.23 83.66,62.23 84.93,60.96 U$1.21/A7
STEP  (via drill 0.35)
  Top 0.254: v62.87,65.09 60.8,67.15 60.8,68.74 SV1.14
  Bottom 0.254: SV1.6 50.8,71.12 58.42,71.12 SV1.14 | U$1.3 77.15,65.09 v62.87,65.09
V1
  Top 0.381: IC1.4 IC1.2 41.75,55.24 41.75,54.93 38.42,51.59 38.42,40.32 SV2.2
V2
  Top 0.381: IC2.2 IC2.4 53.18,60.96 49.53,60.96 47.94,59.37 47.94,40.32 SV2.4
VALVE1  (via drill 0.35)
  Top 0.254: v40.64,56.99 40.64,56.36 39.69,55.4 IC1.1
  Bottom 0.254: v40.64,56.99 41.75,58.1 76.83,58.1 78.42,59.69 91.12,59.69 93.66,57.15 94.3,57.15 95.25,56.2 95.25,50.8 U$1.17/A3
VALVE2  (via drill 0.35)
  Top 0.254: v52.07,56.99 52.07,56.36 51.12,55.4 IC2.1
  Bottom 0.254: v52.07,56.99 54.13,54.93 72.87,54.93 73.18,54.61 92.71,54.61 U$1.18/A4/SDA

### Text on the board
tPlace: + | TEXTURED / WALKWAY V1 / WNG 230308